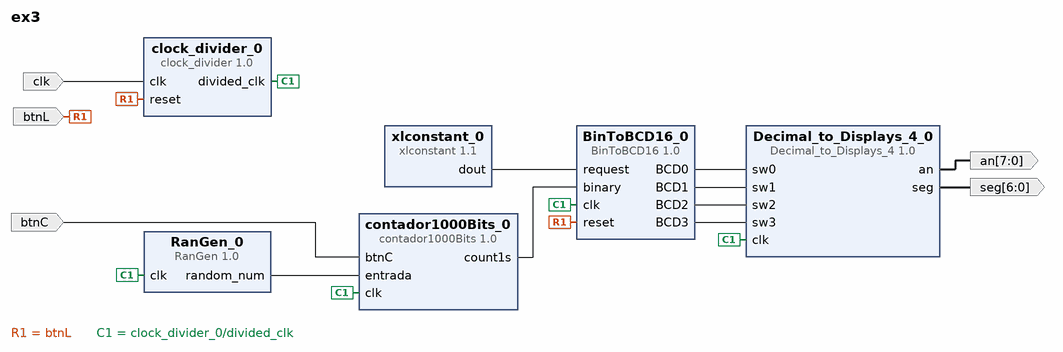
[diagram p0: block diagram of the top level]
# Vivado block design ex3, xc7a100tcsg324-1, Vivado 2016.4
create_bd_design ex3

create_bd_port -dir I -type rst btnL
create_bd_port -dir O -from 7 -to 0 an
create_bd_port -dir O -from 6 -to 0 seg
create_bd_port -dir I btnC
create_bd_port -dir I -type clk clk
set_property -dict {CONFIG.FREQ_HZ 100000000} [get_bd_ports clk]

create_bd_cell -type ip -vlnv xilinx.com:user:BinToBCD16:1.0 BinToBCD16_0
create_bd_cell -type ip -vlnv xilinx.com:user:RanGen:1.0 RanGen_0
create_bd_cell -type ip -vlnv xilinx.com:user:clock_divider:1.0 clock_divider_0
create_bd_cell -type ip -vlnv xilinx.com:ip:xlconstant:1.1 xlconstant_0
create_bd_cell -type ip -vlnv xilinx.com:user:Decimal_to_Displays_4:1.0 Decimal_to_Displays_4_0
create_bd_cell -type ip -vlnv xilinx.com:user:contador1000Bits:1.0 contador1000Bits_0

# ---- connections ----

connect_bd_net [get_bd_ports btnL] [get_bd_pins clock_divider_0/reset] [get_bd_pins BinToBCD16_0/reset]
connect_bd_net [get_bd_pins xlconstant_0/dout] [get_bd_pins BinToBCD16_0/request]
connect_bd_net [get_bd_pins BinToBCD16_0/BCD0] [get_bd_pins Decimal_to_Displays_4_0/sw0]
connect_bd_net [get_bd_pins BinToBCD16_0/BCD1] [get_bd_pins Decimal_to_Displays_4_0/sw1]
connect_bd_net [get_bd_pins BinToBCD16_0/BCD2] [get_bd_pins Decimal_to_Displays_4_0/sw2]
connect_bd_net [get_bd_pins BinToBCD16_0/BCD3] [get_bd_pins Decimal_to_Displays_4_0/sw3]
connect_bd_net [get_bd_pins Decimal_to_Displays_4_0/an] [get_bd_ports an]
connect_bd_net [get_bd_pins Decimal_to_Displays_4_0/seg] [get_bd_ports seg]
connect_bd_net [get_bd_ports clk] [get_bd_pins clock_divider_0/clk]
connect_bd_net [get_bd_pins clock_divider_0/divided_clk] \
  [get_bd_pins RanGen_0/clk] [get_bd_pins BinToBCD16_0/clk] [get_bd_pins Decimal_to_Displays_4_0/clk] \
  [get_bd_pins contador1000Bits_0/clk]
connect_bd_net [get_bd_ports btnC] [get_bd_pins contador1000Bits_0/btnC]
connect_bd_net [get_bd_pins RanGen_0/random_num] [get_bd_pins contador1000Bits_0/entrada]
connect_bd_net [get_bd_pins contador1000Bits_0/count1s] [get_bd_pins BinToBCD16_0/binary]

validate_bd_design
save_bd_design
